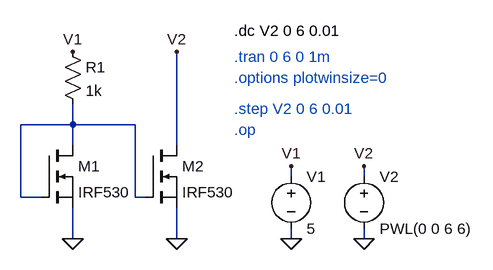
[diagram p0: schematic rout_dc.asc]
rout_dc.asc, the LTspice schematic file:
Version 4
SHEET 1 1116 892
WIRE 176 80 176 48
WIRE 176 80 96 80
WIRE 272 80 176 80
WIRE 176 112 176 80
WIRE 336 112 336 -32
WIRE 512 160 512 144
WIRE 624 160 624 144
WIRE 96 192 96 80
WIRE 128 192 96 192
WIRE 272 192 272 80
WIRE 288 192 272 192
WIRE 176 256 176 208
WIRE 336 256 336 208
WIRE 512 256 512 240
WIRE 624 256 624 240
FLAG 176 256 0
FLAG 336 256 0
FLAG 512 256 0
FLAG 624 256 0
FLAG 176 -32 V1
FLAG 336 -32 V2
FLAG 512 144 V1
FLAG 624 144 V2
SYMBOL nmos 128 112 R0
SYMATTR InstName M1
SYMATTR Value IRF530
SYMBOL res 160 -48 R0
SYMATTR InstName R1
SYMATTR Value 1k
SYMBOL voltage 512 144 R0
WINDOW 123 0 0 Left 0
WINDOW 39 0 0 Left 0
SYMATTR InstName V1
SYMATTR Value 5
SYMBOL voltage 624 144 R0
WINDOW 123 0 0 Left 0
WINDOW 39 0 0 Left 0
SYMATTR InstName V2
SYMATTR Value PWL(0 0 6 6)
SYMBOL nmos 288 112 R0
SYMATTR InstName M2
SYMATTR Value IRF530
TEXT 424 -64 Left 0 !.dc V2 0 6 0.01
TEXT 424 56 Left 0 ;.step V2 0 6 0.01
TEXT 424 88 Left 0 ;.op
TEXT 424 -24 Left 0 ;.tran 0 6 0 1m
TEXT 424 8 Left 0 ;.options plotwinsize=0

The netlist it stands for:
* rout_dc.asc
M1 N001 N001 0 0 IRF530
R1 V1 N001 1k
V1 V1 0 5
V2 V2 0 PWL(0 0 6 6)
M2 V2 N001 0 0 IRF530
.model NMOS NMOS
.model PMOS PMOS
.lib standard.mos
.dc V2 0 6 0.01
* .step V2 0 6 0.01
* .op
* .tran 0 6 0 1m
* .options plotwinsize=0
.backanno
.end